# Altium schematic sheet probe.SchDoc
size A4; SheetNumber: 6; SheetTotal: 7
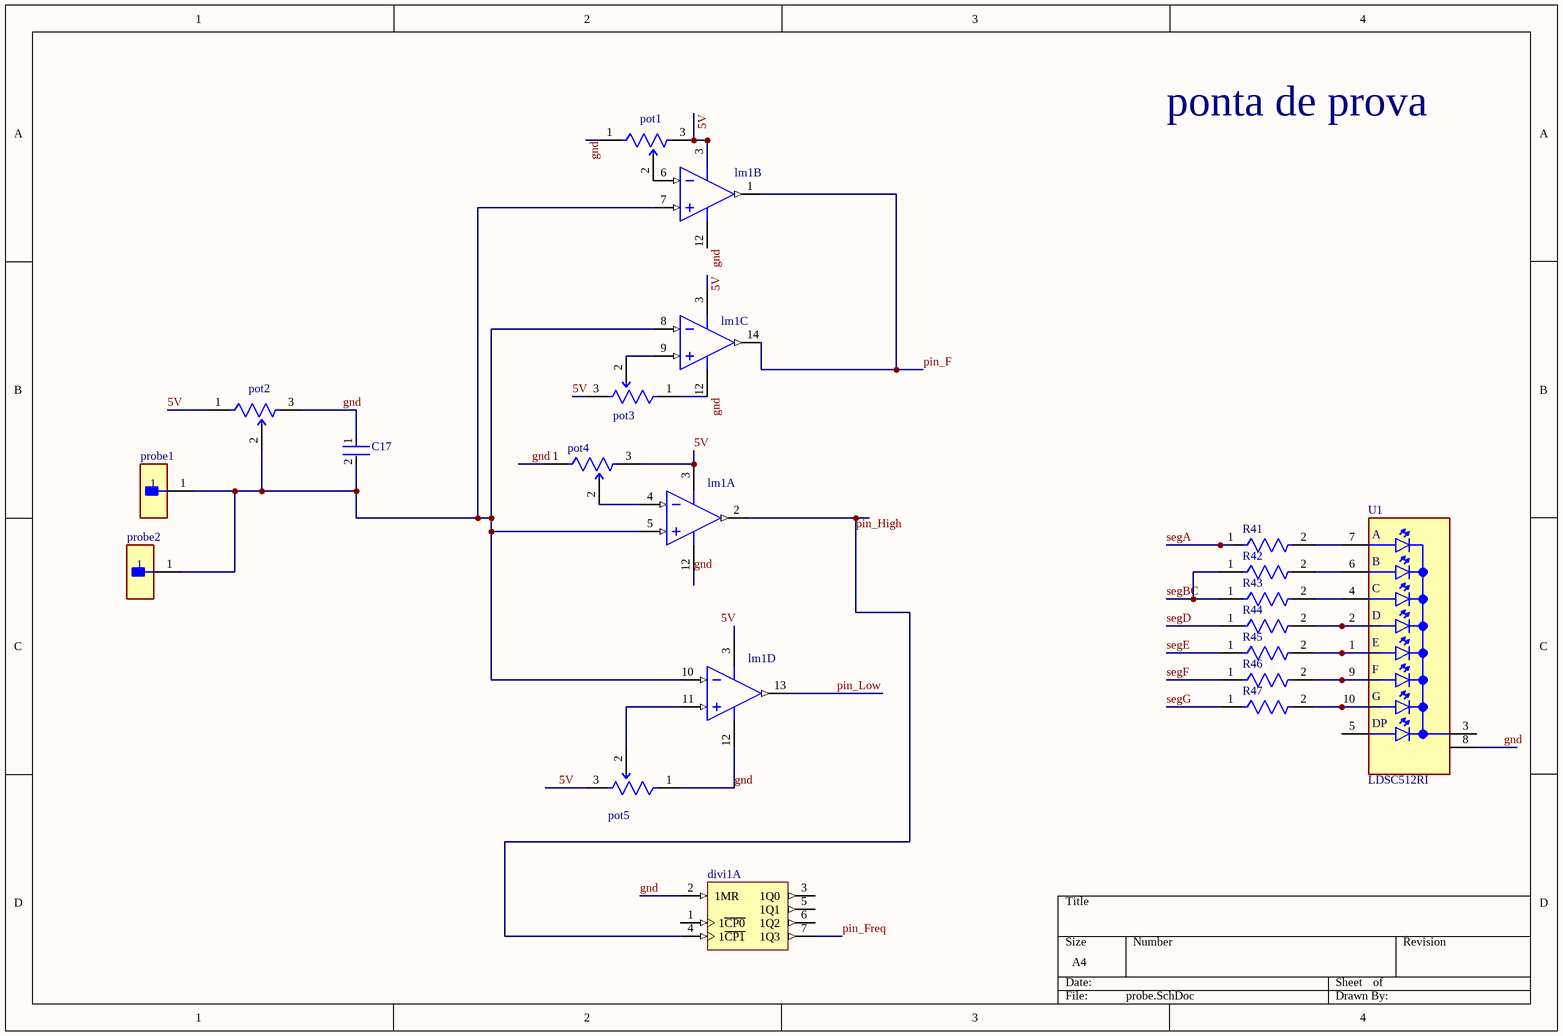
[diagram p0: probe.SchDoc]

## Parts
C17  RCER71H335K3K1H03B  [FP-RCE3M1-MFG]  (value not drawn)
divi1  CD74HC390E  [N0016A]  (value not drawn)  (part A of 3)
lm1  LM339J  [J0014A]  (value not drawn)  (parts A,B,C,D of 4)
pot1  3296W-1-501LF  [FP-3296W-MFG]  (value not drawn)
pot2  3296W-1-501LF  [FP-3296W-MFG]  (value not drawn)
pot3  3296W-1-501LF  [FP-3296W-MFG]  (value not drawn)
pot4  3296W-1-501LF  [FP-3296W-MFG]  (value not drawn)
pot5  3296W-1-501LF  [FP-3296W-MFG]  (value not drawn)
probe1  TSW-101-07-L-S  [FP-TSW-101-07-L-S-MFG]  (value not drawn)
probe2  TSW-101-07-L-S  [FP-TSW-101-07-L-S-MFG]  (value not drawn)
R41  MRS16000C2002FCT00  [FP-MRS1600-MFG]  (value not drawn)
R42  MRS16000C2002FCT00  [FP-MRS1600-MFG]  (value not drawn)
R43  MRS16000C2002FCT00  [FP-MRS1600-MFG]  (value not drawn)
R44  MRS16000C2002FCT00  [FP-MRS1600-MFG]  (value not drawn)
R45  MRS16000C2002FCT00  [FP-MRS1600-MFG]  (value not drawn)
R46  MRS16000C2002FCT00  [FP-MRS1600-MFG]  (value not drawn)
R47  MRS16000C2002FCT00  [FP-MRS1600-MFG]  (value not drawn)
U1  LDSC512RI  [LED_LDSC512RI]

## Nets
5V: lm1.3(V+) pot1.3(CW) pot2.1(CCW) pot3.3(CW) pot4.3(CW) pot5.3(CW)
gnd: C17.1 divi1.2(1MR) lm1.12(GND) pot1.1(CCW) pot2.3(CW) pot3.1(CCW) pot4.1(CCW) pot5.1(CCW) U1.8(CC)
pin_F: lm1.1(OUT2) lm1.14(OUT3)
pin_Freq: divi1.7(1Q3)
pin_High: divi1.4(1~{CP1}) lm1.2(OUT1)
pin_Low: lm1.13(OUT4)
segA: R41.1
segBC: R42.1 R43.1
segD: R44.1
segE: R45.1
segF: R46.1
segG: R47.1
NetC17_2: C17.2 lm1.5(IN1+) lm1.7(IN2+) lm1.8(IN3-) lm1.10(IN4-) pot2.2(WIPER) probe1.1 probe2.1
Netlm1_4: lm1.4(IN1-) pot4.2(WIPER)
Netlm1_6: lm1.6(IN2-) pot1.2(WIPER)
Netlm1_9: lm1.9(IN3+) pot3.2(WIPER)
Netlm1_11: lm1.11(IN4+) pot5.2(WIPER)
NetR41_2: R41.2 U1.7(A)
NetR42_2: R42.2 U1.6(B)
NetR43_2: R43.2 U1.4(C)
NetR44_2: R44.2 U1.2(D)
NetR45_2: R45.2 U1.1(E)
NetR46_2: R46.2 U1.9(F)
NetR47_2: R47.2 U1.10(G)

Not connected (* = marked no-connect by the designer): divi1 1(1~{CP0}) 3(1Q0) 5(1Q1) 6(1Q2); U1 3(CC) 5(DP)

## Notes on the sheet
- ponta de prova
- Labels drawn without touching a wire or pin: 5V

## Library data of the parts
C17 = CMP-06035-028451-1: Cap Ceramic 3.3uF 50V X7R ±10% Radial 5mm +125°C Automotive Ammo Pack; Lead Diameter: 0.5mm; Lead/Base Style: Formed Leads; Height: 5mm; Ratings: AEC-Q200; Capacitance: 3.3uF; Package Quantity: 500; Length: 0.217inch; Min Operating Temperature: -55°C; Voltage Rating (DC): 50V; Dielectric: X7R; Case/Package: Radial; Height - Seated (Max): 0.197inch; Termination: Radial; Mount: Through Hole; Max Operating Temperature: 125°C; Width: 0.157inch; Voltage Rating: 50V; Packaging: Bulk; Resistor Type: Ceramic; Tolerance: 10%; Lead Pitch: 0.197inch
divi1 = CMP-1623-00557-2: High Speed CMOS Logic Dual Decade Ripple Counters, N0016A, TUBE; Manufacturer: Texas Instruments; Technology Family: HC; ICC @ Nom Voltage(Max)(mA): 0.08; Inputs: 1; F @ Nom Voltage(Max)(Mhz): 28; tpd @ Nom Voltage(Max)(ns): 52; Bits(#): 4; Input Type: LVTTL/CMOS; Schmitt Trigger: No; Output Drive (IOL/IOH)(Max)(mA): 5.2/-5.2; VCC(Max)(V): 6; Rating: Catalog; VCC(Min)(V): 2; Voltage(Nom)(V): 3.3,5; Output Type: CMOS; Code_JEDEC: MS-001; Generic Part Number: CD74HC390; DatasheetVersion: SCHS185C; Function: Counter; Operating Temperature Range(C): -55 to 125; Type: Decade; PackageReference: N0016A
lm1 = CMP-0060-00012-3: Low Power Low Offset Voltage Quad Comparator, 14-pin CerDIP; Manufacturer: Texas Instruments; PowerWise: N; PackageTopMarking: NSUZXYYTT*LM339J; PackageDescription: Cerdip, .400 x .310in Body, 14 Lead, .300in Centers, .100in Pitch; ComponentLink1Description: Datasheet URL; PinCount: 14; PackageReference: J0014A; ComponentLink1URL: http://www.ti.com/general/docs/lit/getliterature.tsp?genericPartNumber=LM339-N&fileType=pdf; CompType: Comparator; RoHS: N
pot1-pot5 = CMP-07234-000046-1: TRIMMER 500 OHM 0.5W PC PIN TOP; Resistance: 500R; Temperature Coefficient: 100ppm/°C; Resistance Tolerance: 10%; Number of Turns: 25; Max Power Dissipation: 500mW; Packaging: Rail/Tube; Color: Blue; Technology: CERMET; Max Operating Temperature: 125°C; RoHS Compliant: Yes; Radiation Hardening: No; Series: 3296; Military Standard: Not; Width: 9.53mm; Weight: 0.03oz; Length: 9.53mm; Package Quantity: 50; Height: 0.395inch; Min Operating Temperature: -55°C; Lead Free: Lead Free; Mount: Through Hole; Depth: 4.83mm; Termination: Pin; Taper: Linear; Contact Plating: Tin; Resistor Type: Cermet; Tolerance: 10%; REACH SVHC: No SVHC; Power Rating: 500mW
probe1 probe2 = CMP-02766-001775-1: CONN HEADER VERT 1POS; Gender: Male; Number of Contacts: 1; Max Current Rating: 7.6A; Max Voltage Rating (AC): 550V; RoHS Compliant: Yes; Contact Finish - Mating: GOLD; Length: 2.54mm; Series: TSW; Insulation Material: PBT; Reach SVHC Compliant: Yes; Radiation Hardening: No; Contact Plating: Gold; Termination: Solder; Contact Type: Male Pin; Orientation: Straight; Number of Rows: 1; Depth: 2.54mm; Housing Material: Polyester; Lead Free: Lead Free; Fastening Type: Pull; Flammability Rating: UL94 V-0; Mount: Through Hole; Housing Color: Black; Contact Shape: Square; Min Operating Temperature: -55°C; Connector Type: Header; Contact Mating Length: 0.23inch; Width: 2.54mm; Packaging: Bulk; Contact Material: Bronze; Max Operating Temperature: 125°C; Number of Positions: 1; Color: Black; Insulation Color: Black
R41-R47 = CMP-02408-000019-1: RES 20K OHM 0.4W 1% AXIAL; Max Power Dissipation: 400mW; Temperature Coefficient: 50ppm/°C; Resistance: 20kR; Technology: THIN FILM; Max Operating Temperature: 155°C; Number of Terminations: 2; RoHS Compliant: Yes; Packaging: Tape and Reel; Radiation Hardening: No; Contact Plating: Tin; Military Standard: Not; Construction: Cylindrical; Diameter: 1.6mm; Tolerance: 1%; Mount: Through Hole; Power Rating: 400mW; Case/Package: Conformal; Termination: Axial; Length: 3.6mm; Min Operating Temperature: -55°C; Resistor Type: Metal Film; Series: MRS16
U1 = LDSC512RI: .56IN. 7 SEGMENT SINGLE DISPLAY, 565NM GREEN, GRAY FACE, WHITE SEGMENTS, COMMON | Lumex LDS-C512RI; SnapEDA_Link: https://www.snapeda.com/parts/LDS-C512RI/Lumex/view-part/?ref=snap; Package: None; Value: *; MF: Lumex; MP: LDS-C512RI; Check_prices: https://www.snapeda.com/parts/LDS-C512RI/Lumex/view-part/?ref=eda